# EAGLE design LinearSlewLimiter (EAGLE 7.2.0)
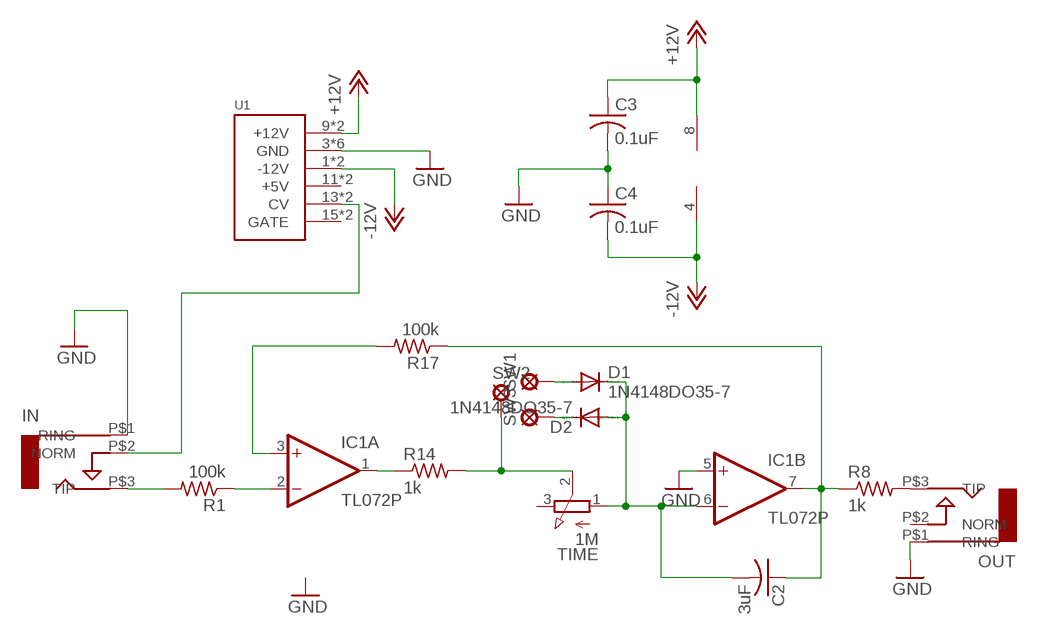
[diagram p0: schematic, sheet 1]

## Parts
C2  3uF  C-US050-055X075  [C050-055X075]
C3  0.1uF  C-US025-030X050  [C025-030X050]
C4  0.1uF  C-US025-030X050  [C025-030X050]
D1  1N4148DO35-7  [DO35-7]
D2  1N4148DO35-7  [DO35-7]
IC1  TL072P  [DIL08]
IN  AUDIO-JACK  [ERTHENVAR-JACK-90DEG]
OUT  AUDIO-JACK  [ERTHENVAR-JACK-90DEG]
R1  100k  R-US_0207/7  [0207/7]
R8  1k  R-US_0207/7  [0207/7]
R14  1k  R-US_0207/7  [0207/7]
R17  100k  R-US_0207/7  [0207/7]
SW1  LSP10  [LSP10]
SW2  LSP10  [LSP10]
SW3  LSP10  [LSP10]
TIME  1M  3RP/1610N  [3RP/1610N]
U1  POWER  [POWER_16]

## Nets
+12V: C3.1 IC1.8(P:V+) U1.9(+12V) U1.10(+12V)
-12V: C4.2 IC1.4(P:V-) U1.1(-12V) U1.2(-12V)
GND: C3.2 C4.1 IC1.5(B:+IN) IN.P$1(RING) OUT.P$1(RING) U1.3(GND) U1.4(GND) U1.5(GND) U1.6(GND) U1.7(GND) U1.8(GND)
N$1: IC1.2(A:-IN) R1.1
N$2: C2.1 IC1.7(B:OUT) R8.1 R17.1
N$3: IN.P$3(TIP) R1.2
N$4: C2.2 D1.C D2.A IC1.6(B:-IN) TIME.1(A)
N$5: R14.2 SW2.MP TIME.2(S)
N$6: IC1.1(A:OUT) R14.1
N$7: IC1.3(A:+IN) R17.2
N$8: D1.A SW1.MP
N$9: D2.C SW3.MP
N$10: OUT.P$3(TIP) R8.2
N$55: IN.P$2(NORM) U1.13(CV) U1.14(CV)
Unconnected: OUT.P$2(NORM) TIME.3(E) U1.11(+5V) U1.12(+5V) U1.15(GATE) U1.16(GATE)

## Library data of the parts
C2-C4 = rcl:C-US: CAPACITOR, American symbol
D1 D2 = diode:1N4148: DIODE high speed (Philips)
IC1 = linear:TL072: OP AMP
IN OUT = erthenvar:AUDIO-JACK: Switching Mono 3.5mm Audio Jack from Erthenvar.
R1 R8 R14 R17 = rcl:R-US_: RESISTOR, American symbol
SW1-SW3 = solpad:LSP10: SOLDER PAD drill 1.0 mm, distributor Buerklin, 12H555
TIME = pot:3RP/1610N: 16mm Potentiometer one level Source: http://www.alphapotentiometers.net/html/16mm_pot_2.html
U1 = eurorack:POWER

## Board
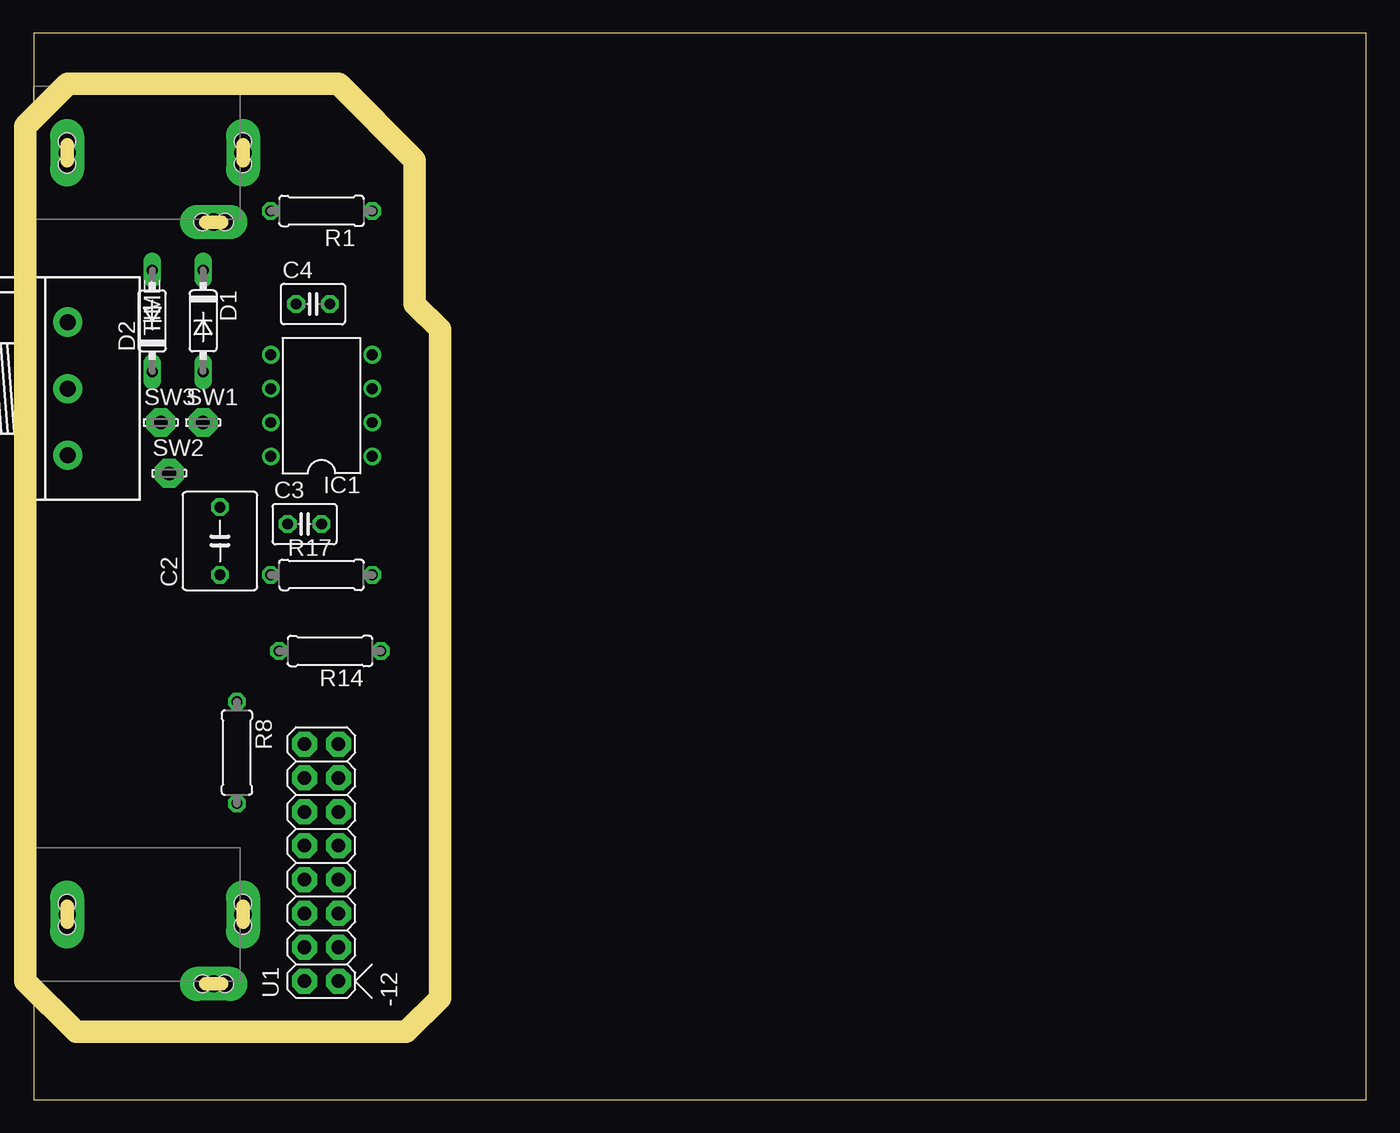
[diagram p1: board, top side]
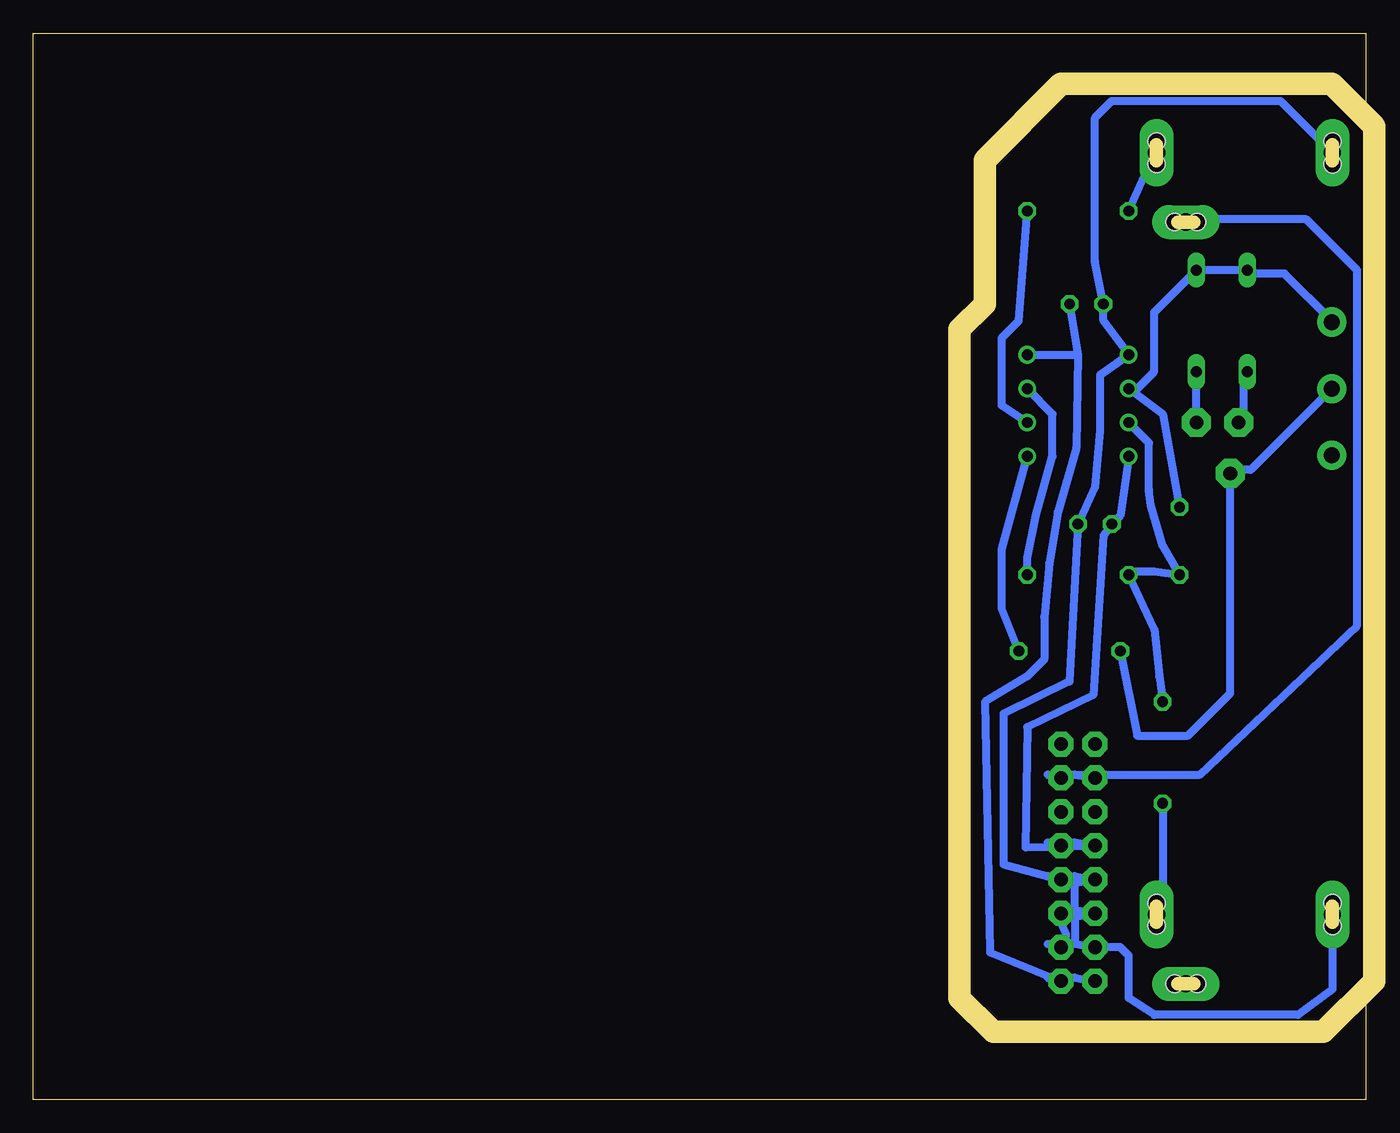
[diagram p2: board, bottom side, seen from below]

Size 100 x 80 mm. Coordinates in mm from the lower left corner, seen from the top.
Outline: 0,0 100,0 100,80 0,80 0,0
Copper layers (1*16): Top 0.035mm / dielectric 1.5mm / Bottom 0.035mm
Design rules "default *": minimum track width 24mil, minimum drill 24mil, track to track 16mil, track to pad 16mil, pad to pad 16mil, via to via 16mil, smd to smd 8mil, copper to edge 0mil, drill to drill 8mil, minimum pad ring 10mil, minimum via ring 8mil, stop-mask expansion 4mil, vias tented up to drill 0mil, thermal gap 10mil
Milling: 10 lines

### Footprints (pad centres in the part's own frame; a part is rotated, then mirrored left to right if it is on the bottom)
C050-055X075 = drill 0.813 octagon: 1 -2.54,0; 2 2.54,0
C025-030X050 = drill 0.813 octagon: 1 -1.27,0; 2 1.27,0
DO35-7 = drill 0.813 long: A 3.81,0; C -3.81,0
DIL08 = drill 0.813 pad 1.27: 1 -3.81,-3.81; 2 -1.27,-3.81; 3 1.27,-3.81; 4 3.81,-3.81; 5 3.81,3.81; 6 1.27,3.81; 7 -1.27,3.81; 8 -3.81,3.81
ERTHENVAR-JACK-90DEG = drill 1.3 pad 2.54 long: P$1 5,-2.5; P$2 -0.2,-13.5; P$3 5,-15.7 | hole 1.3: 5.842,-2.489; 4.14,-2.489; -0.203,-12.649; -0.203,-14.351; 5.842,-15.697; 4.166,-15.697
0207/7 = drill 0.813 octagon: 1 -3.81,0; 2 3.81,0
LSP10 = drill 1.016 pad 2.159 octagon: MP 0,0
3RP/1610N = drill 1.2 pad 2.184: 1 -5,0; 2 0,0; 3 5,0
POWER_16 = drill 1.016 pad 1.88 octagon: 1 -6.35,-1.27; 2 -6.35,1.27; 3 -3.81,-1.27; 4 -3.81,1.27; 5 -1.27,-1.27; 6 -1.27,1.27; 7 1.27,-1.27; 8 1.27,1.27; 9 3.81,-1.27; 10 3.81,1.27; 11 6.35,-1.27; 12 6.35,1.27; 13 8.89,-1.27; 14 8.89,1.27; 15 11.43,-1.27; 16 11.43,1.27

### Placement (x,y rotation side)
C2  13.97,41.91 90 top
C3  20.32,43.18 0 top
C4  20.95,59.69 0 top
D1  12.7,58.42 270 top
D2  8.89,58.42 90 top
IC1  21.59,52.07 90 top
IN  0,66.04 90 top
OUT  0,8.89 90 top
R1  21.59,66.67 180 top
R8  15.24,26.04 270 top
R14  22.23,33.66 180 top
R17  21.59,39.37 0 top
SW1  12.7,50.8 0 top
SW2  10.16,46.99 0 top
SW3  9.53,50.8 0 top
TIME  2.54,53.34 270 top
U1  21.59,15.24 90 top

### Tracks (layer width: path | path; a pad name or v marks a point on that pad's centre or on a via)
+12V
  Bottom 0.61: U1.9 23.88,19.3 21.84,19.3 U1.10 25.53,18.92 25.4,27.94 20.45,30.35 19.68,42.29 C3.1 18.41,43.81 IC1.8
-12V
  Bottom 0.61: U1.2 21.84,9.14 23.88,9.14 U1.1 28.19,11.05 28.57,29.84 25.4,31.75 24.13,33.02 24.13,36.2 23.75,40.26 23.11,44.07 21.72,48.9 21.59,55.88 | C4.2 21.59,55.88 | IC1.4 21.59,55.88
GND
  Bottom 0.61: 21.84,11.68 21.84,13.72 U1.6 21.84,14.22 21.84,16.26 U1.8 21.84,16.76 23.88,16.76 U1.7 27.18,17.65 27.18,28.96 22.23,31.37 C3.2 20.32,45.97 19.94,50.16 19.94,54.36 IC1.5 19.68,58.42 C4.1 20.32,62.87 20.32,73.66 19.05,74.93 6.39,74.93 IN.P$1 | U1.5 23.11,13.72 22.48,12.32 U1.3 23.88,11.68 21.84,11.68 | 21.84,11.68 U1.4 18.41,11.43 17.78,10.79 17.78,7.62 15.88,6.35 5.08,6.35 2.5,8.29 OUT.P$1
N$1
  Bottom 0.61: R1.1 26.04,58.42 27.3,57.15 27.3,52.07 IC1.2
N$2
  Bottom 0.61: R8.1 15.49,31.75 15.88,35.31 R17.1 17.78,39.62 15.88,39.62 C2.1 15.24,41.53 15.49,42.42 16.13,44.58 16.26,45.72 16.26,49.28 IC1.7
N$3
  Bottom 0.61: R1.2 15.78,71.12 IN.P$3
N$4
  Bottom 0.61: C2.2 15.24,51.44 IC1.6 17.14,53.34 15.88,54.61 15.88,59.05 D1.C D2.A 8.64,61.98 6.1,61.98 2.54,58.42 TIME.1
N$5
  Bottom 0.61: TIME.2 8.64,47.24 10.16,47.24 SW2.MP 10.16,30.48 13.34,27.3 17.14,27.3 R14.2
N$6
  Bottom 0.61: R14.1 27.3,36.83 27.3,41.27 IC1.1
N$7
  Bottom 0.61: R17.2 25.4,40.64 24.77,43.81 23.5,48.26 23.5,51.44 IC1.3
N$8
  Bottom 0.61: SW1.MP D1.A
N$9
  Bottom 0.61: D2.C 9.14,54.36 9.14,50.8 SW3.MP
N$10
  Bottom 0.61: R8.2 15.24,14.35 OUT.P$3
N$55
  Bottom 0.61: 21.84,24.38 23.88,24.38 U1.13 | 21.84,24.38 U1.14 | 21.84,24.38 12.45,24.38 0.64,35.56 0.64,62.23 4.45,66.04 13.3,66.04 IN.P$2